# Altium project agua.PrjPcb
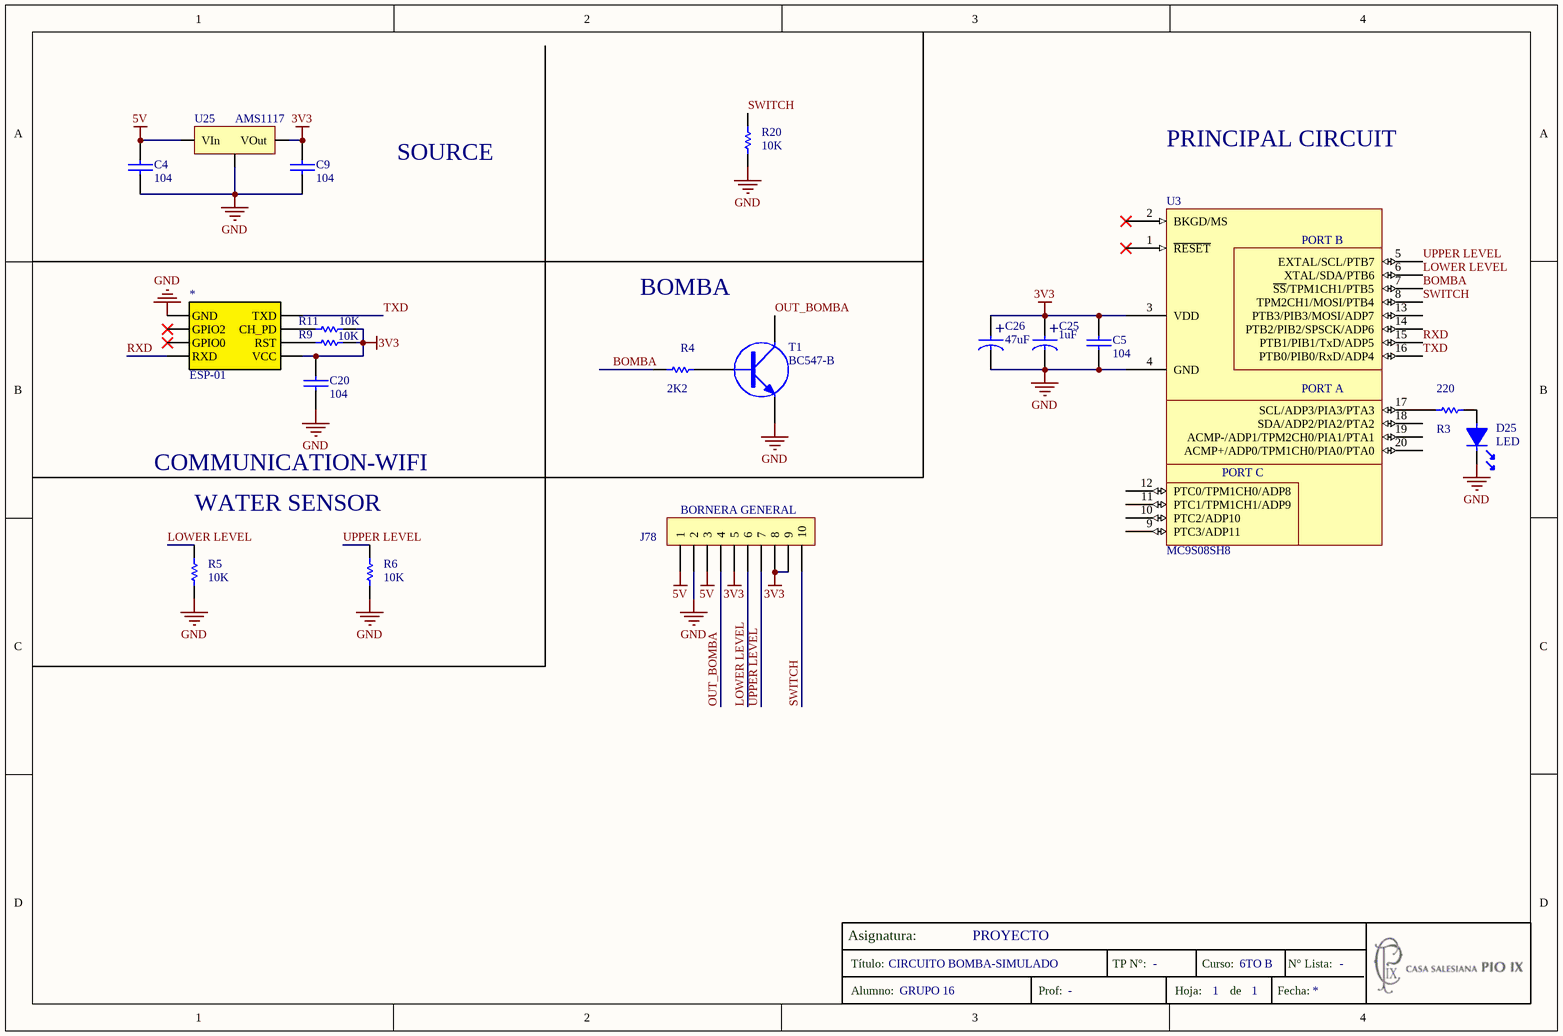
[diagram p0: esquema.SchDoc]
1 sheet, 19 parts. Net scope: global (net labels, ports and power ports of the same name join across sheets).
Board file: pcb.PcbDoc

## Sheet esquema.SchDoc
size A4; SheetNumber: 1; SheetTotal: 1; Titulo: CIRCUITO BOMBA-SIMULADO; Alumno: GRUPO 16; profesor: -; curso: 6TO B; TPN: -; NLista: -; Asignatura: PROYECTO; Año: 2020; Rule: PcbType=ProtelPcb

### Parts
*  ESP-01  [ESP-01]
C4  104  [0805]
C5  104  [0805]
C9  104  [0805]
C20  104  [0805]
C25  1uF  [CAP_SMD]
C26  47uF  [CAP_SMD]
D25  LED  [conector-led]
J78  BORNERA GENERAL  [BORNERA10]
R3  220  [0805]
R4  2K2  [0805]
R5  10K  [0805]
R6  10K  [0805]
R9  10K  [0805]
R11  10K  [0805]
R20  10K  [0805]
T1  BC547-B  [SOT23]
U3  MC9S08SH8  [SH8]
U25  AMS1117  [AMS1117]

### Nets
3V3: *.8(VCC) C5.2 C9.1 C20.1 C25.1 C26.1 J78.5 J78.8 J78.9 R9.1 R11.1 U3.3(VDD) U25.3(VOut)
5V: C4.1 J78.1 J78.3 U25.1(VIn)
GND: *.1(GND) C4.2 C5.1 C9.2 C20.2 C25.2 C26.2 D25.2 J78.2 R5.1 R6.1 R20.1 T1.3(E) U3.4(GND) U25.2(GND)
BOMBA: R4.2 U3.7(~{SS}/TPM1CH1/PTB5)
LOWER LEVEL: J78.6 R5.2 U3.6(XTAL/SDA/PTB6)
OUT_BOMBA: J78.4 T1.2(C)
RXD: *.4(RXD) U3.15(PTB1/PIB1/TxD/ADP5)
SWITCH: J78.10 R20.2 U3.8(TPM2CH1/MOSI/PTB4)
TXD: *.5(TXD) U3.16(PTB0/PIB0/RxD/ADP4)
UPPER LEVEL: J78.7 R6.2 U3.5(EXTAL/SCL/PTB7)
Net*_6: *.6(CH_PD) R11.2
Net*_7: *.7(RST) R9.2
NetD25_1: D25.1 R3.1
NetR3_2: R3.2 U3.17(SCL/ADP3/PIA3/PTA3)
NetR4_1: R4.1 T1.1(B)

Not connected (* = marked no-connect by the designer): * 2(GPIO2)* 3(GPIO0)*; U3 1(~{RESET})* 2(BKGD/MS)* 9(PTC3/ADP11) 10(PTC2/ADP10) 11(PTC1/TPM1CH1/ADP9) 12(PTC0/TPM1CH0/ADP8) 13(PTB3/PIB3/MOSI/ADP7) 14(PTB2/PIB2/SPSCK/ADP6) 18(SDA/ADP2/PIA2/PTA2) 19(ACMP-/ADP1/TPM2CH0/PIA1/PTA1) 20(ACMP+/ADP0/TPM1CH0/PIA0/PTA0)

### Notes on the sheet
- SOURCE
- PRINCIPAL CIRCUIT
- BOMBA
- COMMUNICATION-WIFI
- WATER SENSOR
- Asignatura:
- Título:
- TP N°:
- Curso:
- N° Lista:
- Alumno:
- Prof:
- Hoja:
- de
- Fecha:
- (in symbol CAPPOL) +
- (in symbol MC9S08SH8) PORT B; PORT A; PORT C

### Library data of the parts
C4 C5 C9 C20 = CAP: Autor: Guido Spataro; Data: Libebal; Fecha: 07/04/19
C25 C26 = CAPPOL: Cap polarizado
J78 = BORNERA10
R3-R6 R9 R11 R20 = RES: Resistencia; Autor: Guido Spataro; Data: Libebal; Fecha: 07/04/19
T1 = TRANSISTOR NPN
U3 = MC9S08SH8: Micro controlador; Autor: Guido Spataro; data: https://www.nxp.com/docs/en/data-sheet/MC9S08SH8.pdf; Fecha: 07/04/19